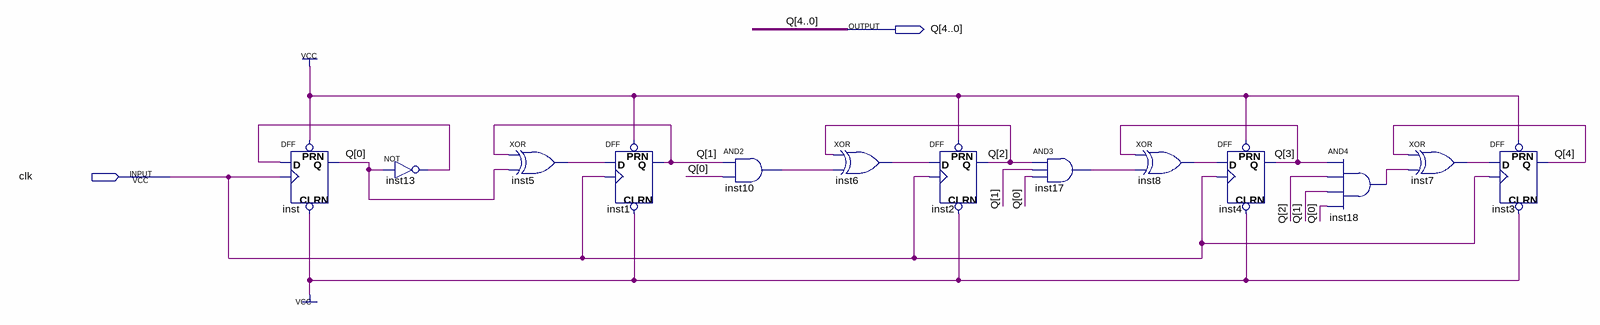
[diagram p0: schematic sheet]
// Quartus schematic counter.bdf as structural Verilog: 13 symbols, 2 pins
module counter (
  input  clk,
  output [4:0] Q
);

  wire inst5_out, inst6_out, inst7_out, inst8_out, inst10_out, inst13_out, inst17_out, inst18_out;

  DFF inst (.CLRN(1'b1), .CLK(clk), .D(inst13_out), .PRN(1'b1), .Q(Q[0]));
  not inst13 (inst13_out, Q[0]);
  xor inst5 (inst5_out, Q[1], Q[0]);
  DFF inst1 (.CLRN(1'b1), .CLK(clk), .D(inst5_out), .PRN(1'b1), .Q(Q[1]));
  and inst10 (inst10_out, Q[1], Q[0]);
  xor inst6 (inst6_out, Q[2], inst10_out);
  DFF inst2 (.CLRN(1'b1), .CLK(clk), .D(inst6_out), .PRN(1'b1), .Q(Q[2]));
  and inst17 (inst17_out, Q[2], Q[1], Q[0]);
  xor inst8 (inst8_out, Q[3], inst17_out);
  DFF inst4 (.CLRN(1'b1), .CLK(clk), .D(inst8_out), .PRN(1'b1), .Q(Q[3]));
  and inst18 (inst18_out, Q[3], Q[2], Q[1], Q[0]);
  xor inst7 (inst7_out, Q[4], inst18_out);
  DFF inst3 (.CLRN(1'b1), .CLK(clk), .D(inst7_out), .PRN(1'b1), .Q(Q[4]));
endmodule
